# EAGLE schematic BeagleBeer (EAGLE 6.4)

## Sheet 1 of 2
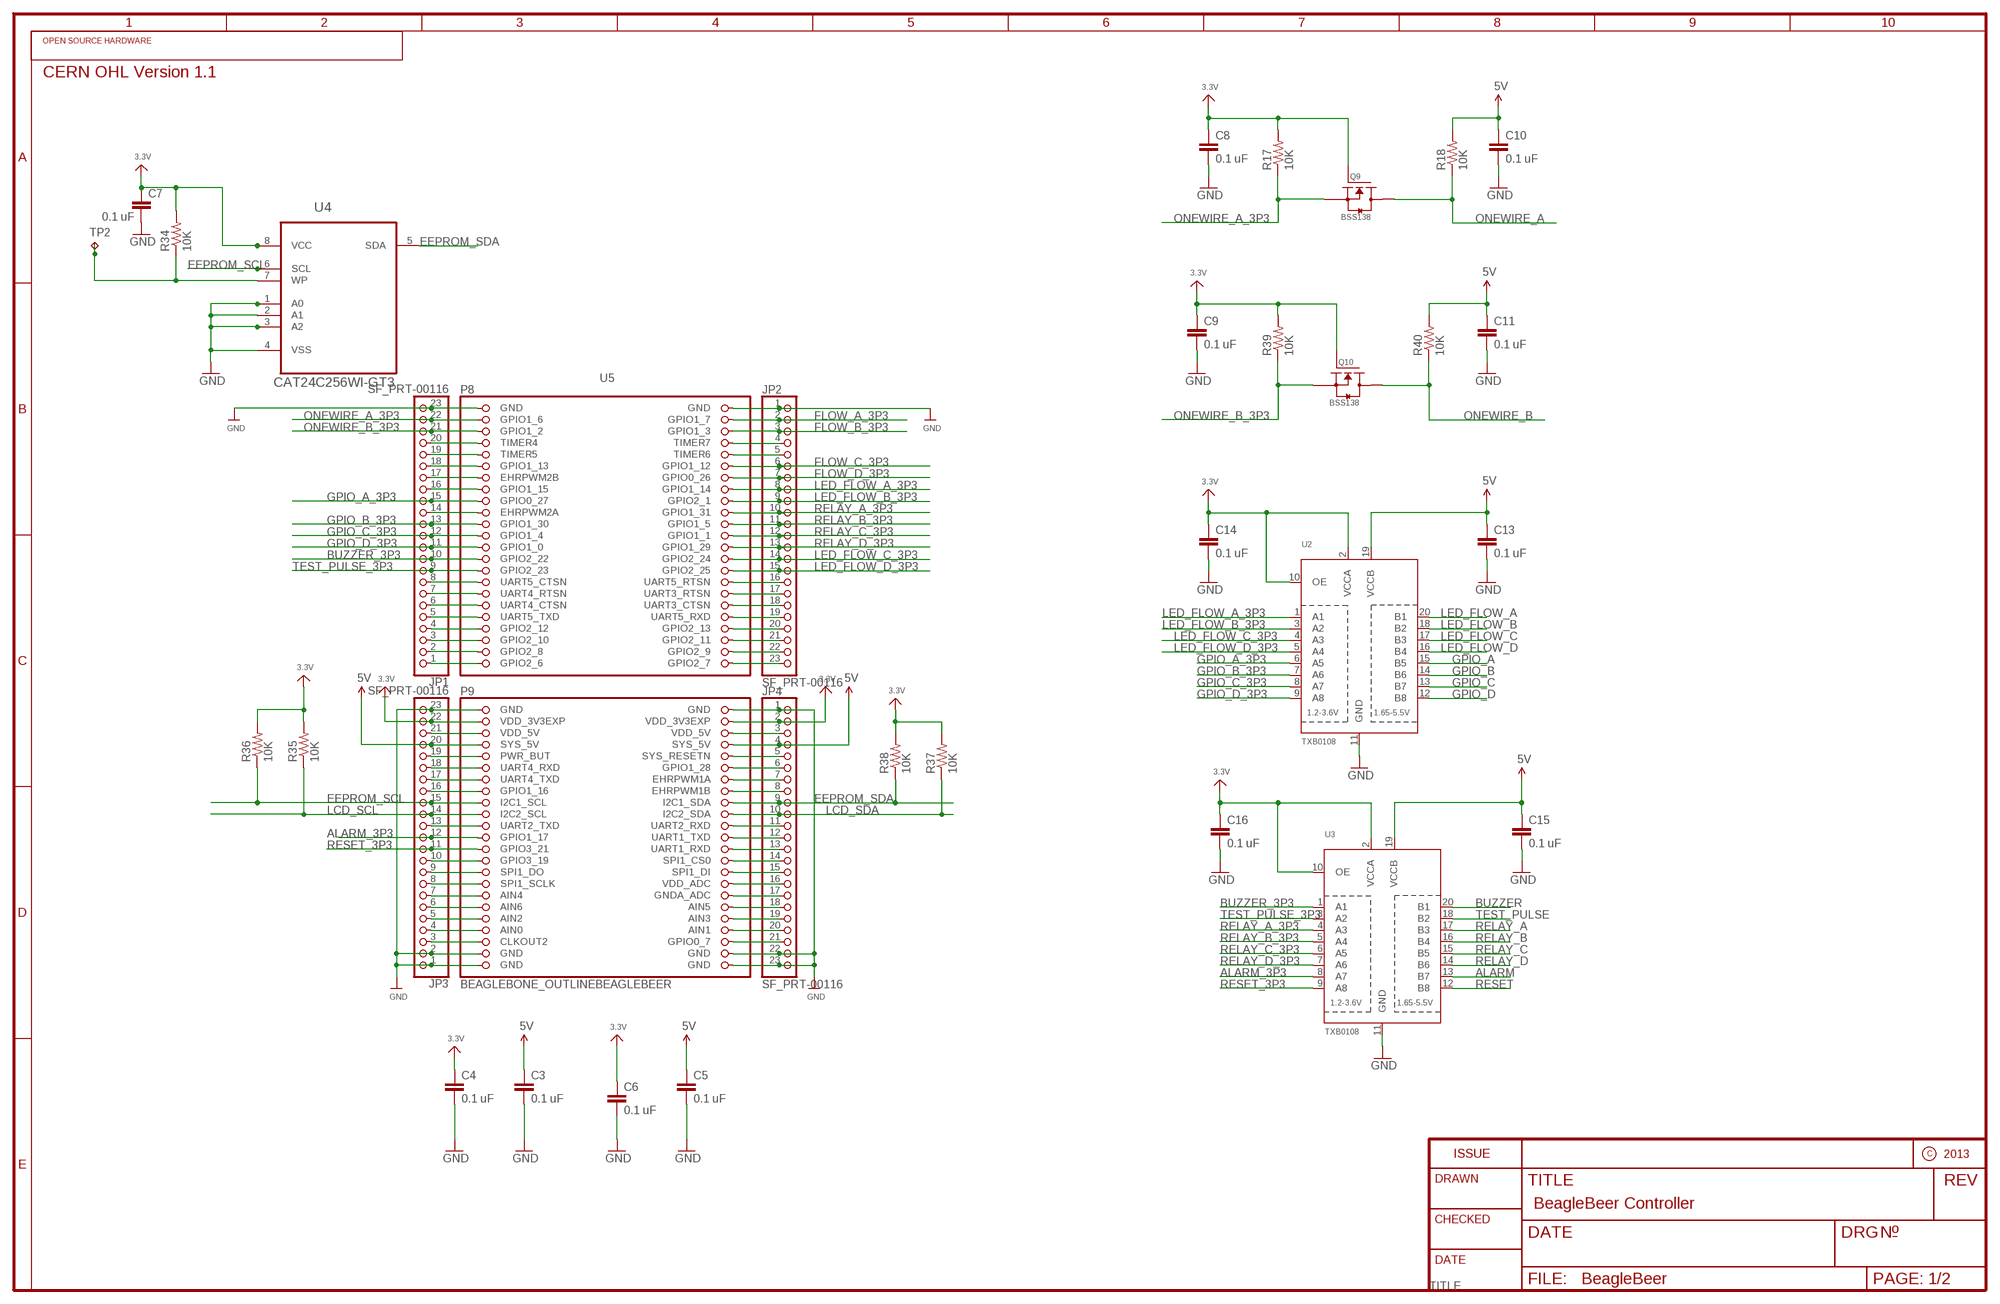
[diagram p0: schematic, sheet 1]
FRAME2 (US_11X17): CHECKED: Robin Coxe; COMPANY: Venture Cafe Foundation; DATE: 12-APR-2013; DRAWN: Robin Coxe; DRGNO: BB-0401; REV: 2; TITLE: BeagleBeer Controller

### Parts
C3  0.1 uF  CAP0805  [0805]
C4  0.1 uF  CAP0805  [0805]
C5  0.1 uF  CAP0805  [0805]
C6  0.1 uF  CAP0805  [0805]
C7  0.1 uF  CAP0805  [0805]
C8  0.1 uF  CAP0805  [0805]
C9  0.1 uF  CAP0805  [0805]
C10  0.1 uF  CAP0805  [0805]
C11  0.1 uF  CAP0805  [0805]
C13  0.1 uF  CAP0805  [0805]
C14  0.1 uF  CAP0805  [0805]
C15  0.1 uF  CAP0805  [0805]
C16  0.1 uF  CAP0805  [0805]
JP1  SF_PRT-00116  HEADER-1X23  [1X23_ROUND_70MIL]
JP2  SF_PRT-00116  HEADER-1X23  [1X23_ROUND_70MIL]
JP3  SF_PRT-00116  HEADER-1X23  [1X23_ROUND_70MIL]
JP4  SF_PRT-00116  HEADER-1X23  [1X23_ROUND_70MIL]
Q9  BSS138  MOSFET-N-GDS-D-SOT323  [SOT323]
Q10  BSS138  MOSFET-N-GDS-D-SOT323  [SOT323]
R17  10K  RESISTOR0805-RES  [0805]
R18  10K  RESISTOR0805-RES  [0805]
R34  10K  RESISTOR0805-RES  [0805]
R35  10K  RESISTOR0805-RES  [0805]
R36  10K  RESISTOR0805-RES  [0805]
R37  10K  RESISTOR0805-RES  [0805]
R38  10K  RESISTOR0805-RES  [0805]
R39  10K  RESISTOR0805-RES  [0805]
R40  10K  RESISTOR0805-RES  [0805]
TP2  TPTP18SQ  [TP18SQ]
U2  TXB0108  TXB0108PWR  [TSSOP20]
U3  TXB0108  TXB0108PWR  [TSSOP20]
U4  CAT24C256WI-GT3  [SOIC127P600X175-8N]
U5  BEAGLEBONE_OUTLINEBEAGLEBEER  [BEAGLEBEER_SHIELD]

### Nets
3.3V: C4.1 C6.1 C7.1 C8.1 C9.1 C14.1 C16.1 JP3.22 JP4.2 Q9.1(G) Q10.1(G) R17.2 R34.2 R35.2 R36.2 R37.2 R38.2 R39.2 U2.2(VCCA) U2.10(OE) U3.2(VCCA) U3.10(OE) U4.8(VCC) U5.49(VDD_3V3EXP) U5.50(VDD_3V3EXP) ; also sheet 2
5V: C3.1 C5.1 C10.1 C11.1 C13.1 C15.1 JP3.20 JP4.4 R18.2 R40.2 U2.19(VCCB) U3.19(VCCB) U5.53(SYS_5V) U5.54(SYS_5V) ; also sheet 2
ALARM: U3.13(B7) ; also sheet 2
ALARM_3P3: JP3.12 U3.8(A7) U5.69(GPIO1_17)
BUZZER: U3.20(B1) ; also sheet 2
BUZZER_3P3: JP1.10 U3.1(A1) U5.27(GPIO2_22)
EEPROM_SCL: JP3.15 R36.1 U4.6(SCL) U5.63(I2C1_SCL)
EEPROM_SDA: JP4.9 R38.1 U4.5(SDA) U5.64(I2C1_SDA)
FLOW_A_3P3: JP2.2 U5.4(GPIO1_7)
FLOW_B_3P3: JP2.3 U5.6(GPIO1_3)
FLOW_C_3P3: JP2.6 U5.12(GPIO1_12)
FLOW_D_3P3: JP2.7 U5.14(GPIO0_26)
GND: C3.2 C4.2 C5.2 C6.2 C7.2 C8.2 C9.2 C10.2 C11.2 C13.2 C14.2 C15.2 C16.2 JP1.23 JP2.1 JP3.1 JP3.2 JP3.23 JP4.1 JP4.22 JP4.23 U2.11(GND) U3.11(GND) U4.1(A0) U4.2(A1) U4.3(A2) U4.4(VSS) U5.1(GND) U5.2(GND) U5.47(GND) U5.48(GND) U5.89(GND) U5.90(GND) U5.91(GND) U5.92(GND) ; also sheet 2
GPIO_A: U2.15(B5) ; also sheet 2
GPIO_A_3P3: JP1.15 U2.6(A5) U5.17(GPIO0_27)
GPIO_B: U2.14(B6) ; also sheet 2
GPIO_B_3P3: JP1.13 U2.7(A6) U5.21(GPIO1_30)
GPIO_C: U2.13(B7) ; also sheet 2
GPIO_C_3P3: JP1.12 U2.8(A7) U5.23(GPIO1_4)
GPIO_D: U2.12(B8) ; also sheet 2
GPIO_D_3P3: JP1.11 U2.9(A8) U5.25(GPIO1_0)
LCD_SCL: JP3.14 R35.1 U5.65(I2C2_SCL)
LCD_SDA: JP4.10 R37.1 U5.66(I2C2_SDA)
LED_FLOW_A: U2.20(B1) ; also sheet 2
LED_FLOW_A_3P3: JP2.8 U2.1(A1) U5.16(GPIO1_14)
LED_FLOW_B: U2.18(B2) ; also sheet 2
LED_FLOW_B_3P3: JP2.9 U2.3(A2) U5.18(GPIO2_1)
LED_FLOW_C: U2.17(B3) ; also sheet 2
LED_FLOW_C_3P3: JP2.14 U2.4(A3) U5.28(GPIO2_24)
LED_FLOW_D: U2.16(B4) ; also sheet 2
LED_FLOW_D_3P3: JP2.15 U2.5(A4) U5.30(GPIO2_25)
N$2: JP1.2 U5.43(GPIO2_8)
N$3: JP1.1 U5.45(GPIO2_6)
N$4: JP1.20 U5.7(TIMER4)
N$5: JP1.19 U5.9(TIMER5)
N$6: JP2.16 U5.32(UART5_RTSN)
N$7: JP1.17 U5.13(EHRPWM2B)
N$8: JP2.17 U5.34(UART3_RTSN)
N$9: JP2.18 U5.36(UART3_CTSN)
N$10: JP1.14 U5.19(EHRPWM2A)
N$11: JP2.19 U5.38(UART5_RXD)
N$12: JP2.20 U5.40(GPIO2_13)
N$13: JP2.21 U5.42(GPIO2_11)
N$14: JP2.22 U5.44(GPIO2_9)
N$15: JP2.23 U5.46(GPIO2_7)
N$16: JP1.8 U5.31(UART5_CTSN)
N$17: JP1.7 U5.33(UART4_RTSN)
N$18: JP1.6 U5.35(UART4_CTSN)
N$19: JP1.5 U5.37(UART5_TXD)
N$20: JP1.4 U5.39(GPIO2_12)
N$21: JP1.3 U5.41(GPIO2_10)
N$27: JP2.4 U5.8(TIMER7)
N$28: JP2.5 U5.10(TIMER6)
N$49: JP3.21 U5.51(VDD_5V)
N$51: JP3.19 U5.55(PWR_BUT)
N$52: JP3.18 U5.57(UART4_RXD)
N$53: JP3.17 U5.59(UART4_TXD)
N$54: JP3.16 U5.61(GPIO1_16)
N$57: JP3.13 U5.67(UART2_TXD)
N$60: JP3.10 U5.73(GPIO3_19)
N$61: JP3.9 U5.75(SPI1_DO)
N$62: JP3.8 U5.77(SPI1_SCLK)
N$63: JP3.7 U5.79(AIN4)
N$64: JP3.6 U5.81(AIN6)
N$65: JP3.5 U5.83(AIN2)
N$66: JP3.4 U5.85(AIN0)
N$67: JP3.3 U5.87(CLKOUT2)
N$69: JP4.21 U5.88(GPIO0_7)
N$72: JP4.3 U5.52(VDD_5V)
N$74: JP4.5 U5.56(SYS_RESETN)
N$75: JP4.6 U5.58(GPIO1_28)
N$76: JP4.7 U5.60(EHRPWM1A)
N$77: JP4.8 U5.62(EHRPWM1B)
N$80: JP4.11 U5.68(UART2_RXD)
N$81: JP4.12 U5.70(UART1_TXD)
N$82: JP4.13 U5.72(UART1_RXD)
N$83: JP4.14 U5.74(SPI1_CS0)
N$84: JP4.15 U5.76(SPI1_DI)
N$85: JP4.16 U5.78(VDD_ADC)
N$86: JP4.17 U5.80(GNDA_ADC)
N$87: JP4.18 U5.82(AIN5)
N$88: JP4.19 U5.84(AIN3)
N$89: JP4.20 U5.86(AIN1)
N$102: R34.1 TP2.TP U4.7(WP)
ONEWIRE_A: Q9.3(D1) R18.1 ; also sheet 2
ONEWIRE_A_3P3: JP1.22 Q9.2(S) R17.1 U5.3(GPIO1_6)
ONEWIRE_B: Q10.3(D1) R40.1 ; also sheet 2
ONEWIRE_B_3P3: JP1.21 Q10.2(S) R39.1 U5.5(GPIO1_2)
ONEWIRE_C_3P3: JP1.18 U5.11(GPIO1_13)
ONEWIRE_D_3P3: JP1.16 U5.15(GPIO1_15)
RELAY_A: U3.17(B3) ; also sheet 2
RELAY_A_3P3: JP2.10 U3.4(A3) U5.20(GPIO1_31)
RELAY_B: U3.16(B4) ; also sheet 2
RELAY_B_3P3: JP2.11 U3.5(A4) U5.22(GPIO1_5)
RELAY_C: U3.15(B5) ; also sheet 2
RELAY_C_3P3: JP2.12 U3.6(A5) U5.24(GPIO1_1)
RELAY_D: U3.14(B6) ; also sheet 2
RELAY_D_3P3: JP2.13 U3.7(A6) U5.26(GPIO1_29)
RESET: U3.12(B8) ; also sheet 2
RESET_3P3: JP3.11 U3.9(A8) U5.71(GPIO3_21)
TEST_PULSE: U3.18(B2) ; also sheet 2
TEST_PULSE_3P3: JP1.9 U3.3(A2) U5.29(GPIO2_23)

### Notes on the sheet
- BeagleBeer Controller

## Sheet 2 of 2
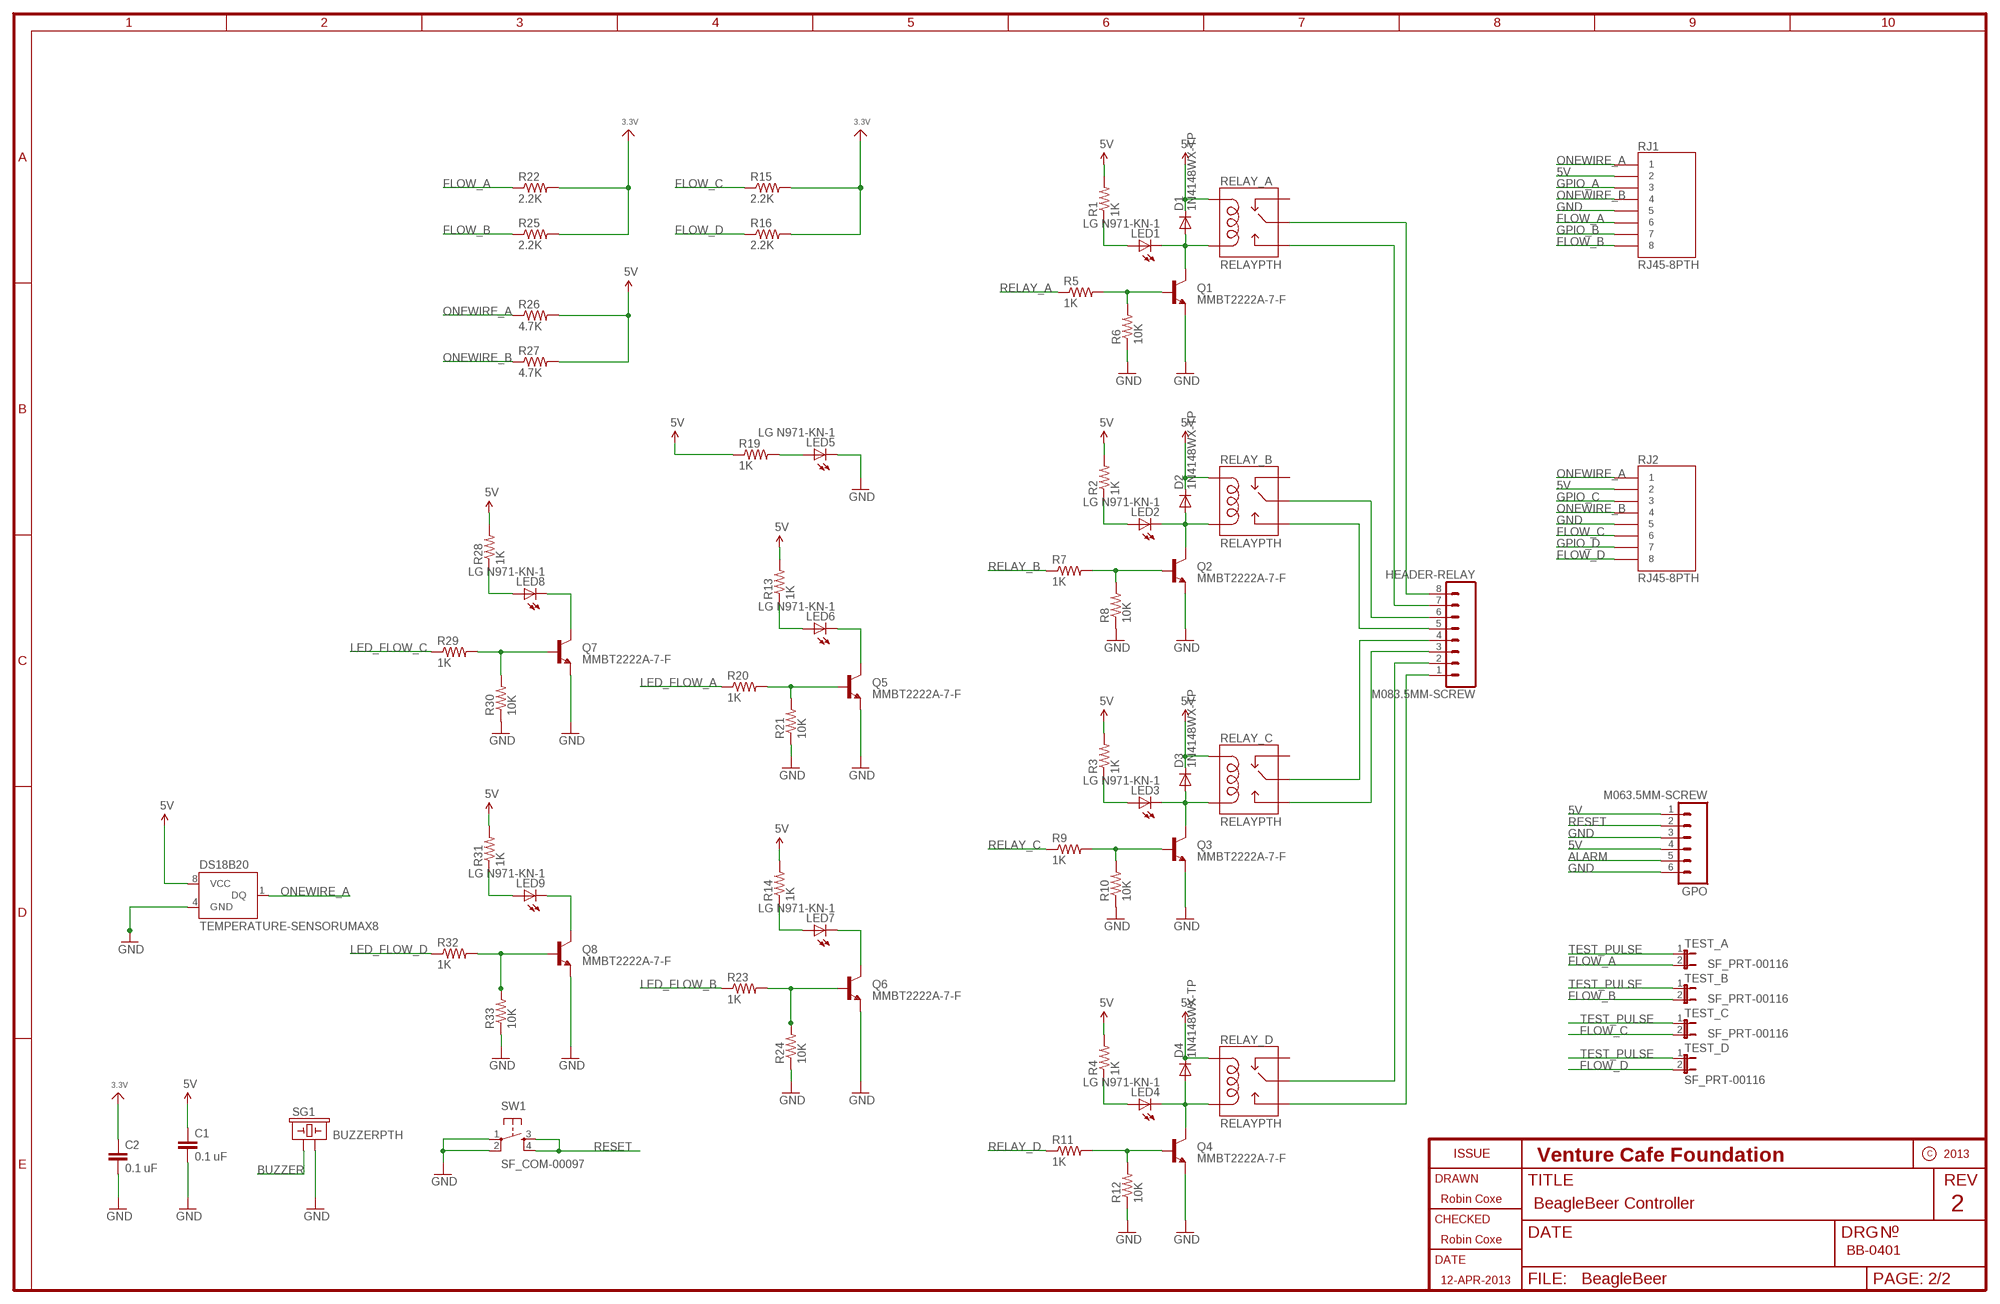
[diagram p1: schematic, sheet 2]
FRAME1 (US_11X17): CHECKED: Robin Coxe; COMPANY: Venture Cafe Foundation; DATE: 12-APR-2013; DRAWN: Robin Coxe; DRGNO: BB-0401; REV: 2

### Parts
C1  0.1 uF  CAP0805  [0805]
C2  0.1 uF  CAP0805  [0805]
D1  1N4148WX-TP  DIODESOD  [SOD-323]
D2  1N4148WX-TP  DIODESOD  [SOD-323]
D3  1N4148WX-TP  DIODESOD  [SOD-323]
D4  1N4148WX-TP  DIODESOD  [SOD-323]
GPO  M063.5MM-SCREW  M063.5MM-6  [SCREWTERMINAL-3.5MM-6]
HEADER-RELAY  M083.5MM-SCREW  M083.5MM-8  [SCREWTERMINAL-3.5MM-8]
LED1  LG N971-KN-1  LED1206  [LED-1206]
LED2  LG N971-KN-1  LED1206  [LED-1206]
LED3  LG N971-KN-1  LED1206  [LED-1206]
LED4  LG N971-KN-1  LED1206  [LED-1206]
LED5  LG N971-KN-1  LED1206  [LED-1206]
LED6  LG N971-KN-1  LED1206  [LED-1206]
LED7  LG N971-KN-1  LED1206  [LED-1206]
LED8  LG N971-KN-1  LED1206  [LED-1206]
LED9  LG N971-KN-1  LED1206  [LED-1206]
Q1  MMBT2222A-7-F  TRANSISTOR_NPNSOT23-3  [SOT23-3]
Q2  MMBT2222A-7-F  TRANSISTOR_NPNSOT23-3  [SOT23-3]
Q3  MMBT2222A-7-F  TRANSISTOR_NPNSOT23-3  [SOT23-3]
Q4  MMBT2222A-7-F  TRANSISTOR_NPNSOT23-3  [SOT23-3]
Q5  MMBT2222A-7-F  TRANSISTOR_NPNSOT23-3  [SOT23-3]
Q6  MMBT2222A-7-F  TRANSISTOR_NPNSOT23-3  [SOT23-3]
Q7  MMBT2222A-7-F  TRANSISTOR_NPNSOT23-3  [SOT23-3]
Q8  MMBT2222A-7-F  TRANSISTOR_NPNSOT23-3  [SOT23-3]
R1  1K  RESISTOR0805-RES  [0805]
R2  1K  RESISTOR0805-RES  [0805]
R3  1K  RESISTOR0805-RES  [0805]
R4  1K  RESISTOR0805-RES  [0805]
R5  1K  RESISTOR0805-RES  [0805]
R6  10K  RESISTOR0805-RES  [0805]
R7  1K  RESISTOR0805-RES  [0805]
R8  10K  RESISTOR0805-RES  [0805]
R9  1K  RESISTOR0805-RES  [0805]
R10  10K  RESISTOR0805-RES  [0805]
R11  1K  RESISTOR0805-RES  [0805]
R12  10K  RESISTOR0805-RES  [0805]
R13  1K  RESISTOR0805-RES  [0805]
R14  1K  RESISTOR0805-RES  [0805]
R15  2.2K  RESISTOR0805-RES  [0805]
R16  2.2K  RESISTOR0805-RES  [0805]
R19  1K  RESISTOR0805-RES  [0805]
R20  1K  RESISTOR0805-RES  [0805]
R21  10K  RESISTOR0805-RES  [0805]
R22  2.2K  RESISTOR0805-RES  [0805]
R23  1K  RESISTOR0805-RES  [0805]
R24  10K  RESISTOR0805-RES  [0805]
R25  2.2K  RESISTOR0805-RES  [0805]
R26  4.7K  RESISTOR0805-RES  [0805]
R27  4.7K  RESISTOR0805-RES  [0805]
R28  1K  RESISTOR0805-RES  [0805]
R29  1K  RESISTOR0805-RES  [0805]
R30  10K  RESISTOR0805-RES  [0805]
R31  1K  RESISTOR0805-RES  [0805]
R32  1K  RESISTOR0805-RES  [0805]
R33  10K  RESISTOR0805-RES  [0805]
RELAY_A  RELAYPTH  [RELAY-G5Q]
RELAY_B  RELAYPTH  [RELAY-G5Q]
RELAY_C  RELAYPTH  [RELAY-G5Q]
RELAY_D  RELAYPTH  [RELAY-G5Q]
RJ1  RJ45-8PTH  [RJ45-8]
RJ2  RJ45-8PTH  [RJ45-8]
SG1  BUZZERPTH  [BUZZER-12MM]
SW1  SF_COM-00097  TAC_SWITCHPTH  [TACTILE-PTH]
TEST_A  SF_PRT-00116  JUMPER-2PTH  [1X02]
TEST_B  SF_PRT-00116  JUMPER-2PTH  [1X02]
TEST_C  SF_PRT-00116  JUMPER-2PTH  [1X02]
TEST_D  SF_PRT-00116  JUMPER-2PTH  [1X02]
U1  TEMPERATURE-SENSORUMAX8  [UMAX8]

### Nets
3.3V: C2.1 R15.2 R16.2 R22.2 R25.2 ; also sheet 1
5V: C1.1 D1.1(C) D2.1(C) D3.1(C) D4.1(C) GPO.1 GPO.4 R1.2 R2.2 R3.2 R4.2 R13.2 R14.2 R19.1 R26.2 R27.2 R28.2 R31.2 RELAY_A.5(COIL1) RELAY_B.5(COIL1) RELAY_C.5(COIL1) RELAY_D.5(COIL1) RJ1.2 RJ2.2 U1.8(VCC) ; also sheet 1
ALARM: GPO.5 ; also sheet 1
BUZZER: SG1.+ ; also sheet 1
FLOW_A: R22.1 RJ1.6 TEST_A.2
FLOW_B: R25.1 RJ1.8 TEST_B.2
FLOW_C: R15.1 RJ2.6 TEST_C.2
FLOW_D: R16.1 RJ2.8 TEST_D.2
GND: C1.2 C2.2 GPO.3 GPO.6 LED5.C Q1.2(E) Q2.2(E) Q3.2(E) Q4.2(E) Q5.2(E) Q6.2(E) Q7.2(E) Q8.2(E) R6.1 R8.1 R10.1 R12.1 R21.1 R24.1 R30.1 R33.1 RJ1.5 RJ2.5 SG1.- SW1.1 SW1.2 U1.4(GND) ; also sheet 1
GPIO_A: RJ1.3 ; also sheet 1
GPIO_B: RJ1.7 ; also sheet 1
GPIO_C: RJ2.3 ; also sheet 1
GPIO_D: RJ2.7 ; also sheet 1
LED_FLOW_A: R20.1 ; also sheet 1
LED_FLOW_B: R23.1 ; also sheet 1
LED_FLOW_C: R29.1 ; also sheet 1
LED_FLOW_D: R32.1 ; also sheet 1
N$1: LED8.C Q7.3(C)
N$25: LED8.A R28.1
N$26: Q7.1(B) R29.2 R30.2
N$42: LED9.C Q8.3(C)
N$70: D1.2(A) LED1.C Q1.3(C) RELAY_A.1(COIL2)
N$71: D2.2(A) LED2.C Q2.3(C) RELAY_B.1(COIL2)
N$73: D3.2(A) LED3.C Q3.3(C) RELAY_C.1(COIL2)
N$90: D4.2(A) LED4.C Q4.3(C) RELAY_D.1(COIL2)
N$91: Q1.1(B) R5.2 R6.2
N$92: Q2.1(B) R7.2 R8.2
N$93: Q3.1(B) R9.2 R10.2
N$94: Q4.1(B) R11.2 R12.2
N$95: LED5.A R19.2
N$96: HEADER-RELAY.8 RELAY_A.2(MAIN)
N$97: HEADER-RELAY.7 RELAY_A.3(NO)
N$98: HEADER-RELAY.6 RELAY_B.2(MAIN)
N$99: HEADER-RELAY.5 RELAY_B.3(NO)
N$100: LED9.A R31.1
N$101: Q8.1(B) R32.2 R33.2
N$106: HEADER-RELAY.4 RELAY_C.2(MAIN)
N$107: HEADER-RELAY.3 RELAY_C.3(NO)
N$108: HEADER-RELAY.2 RELAY_D.2(MAIN)
N$109: HEADER-RELAY.1 RELAY_D.3(NO)
N$111: LED1.A R1.1
N$112: LED2.A R2.1
N$113: LED3.A R3.1
N$114: LED4.A R4.1
N$117: LED6.C Q5.3(C)
N$118: LED6.A R13.1
N$119: Q5.1(B) R20.2 R21.2
N$120: LED7.C Q6.3(C)
N$121: LED7.A R14.1
N$122: Q6.1(B) R23.2 R24.2
ONEWIRE_A: R26.1 RJ1.1 RJ2.1 U1.1(DQ) ; also sheet 1
ONEWIRE_B: R27.1 RJ1.4 RJ2.4 ; also sheet 1
RELAY_A: R5.1 ; also sheet 1
RELAY_B: R7.1 ; also sheet 1
RELAY_C: R9.1 ; also sheet 1
RELAY_D: R11.1 ; also sheet 1
RESET: GPO.2 SW1.3 SW1.4 ; also sheet 1
TEST_PULSE: TEST_A.1 TEST_B.1 TEST_C.1 TEST_D.1 ; also sheet 1
Unconnected: RELAY_A.4(NC) RELAY_B.4(NC) RELAY_C.4(NC) RELAY_D.4(NC)

### Notes on the sheet
- BeagleBeer Controller

## Library data of the parts
C1-C11 C13-C16 = geoffculp:CAP: Capacitor Standard 0603 ceramic capacitor, and 0.1" leaded capacitor.
D1-D4 = geoffculp:DIODE: Diode These are standard reverse protection diodes and small signal diodes. SMA package can handle up to about 1A. SOD-323 can handle about 200mA. What the SOD-323 package when ordering, there are some mfgs out there that are 5-pin packages.
GPO = SparkFun:M06: Header 6 Standard 6-pin 0.1" header. Use with straight break away headers (SKU : PRT-00116), right angle break away headers (PRT-00553), swiss pins (PRT-00743), machine pins (PRT-00117), and female headers (PRT-00115). Molex polarized connector foot print use with SKU : PRT-08094 with associated crimp pins and housings. NOTES ON THE VARIANTS LOCK and LOCK_LONGPADS... This footprint was designed to help hold the alignment of a through-hole component (i.e. 6-pin header) while soldering it into place. You may notice that each hole has been shifted either up or down by 0.005 of an inch from it's more standard position (which is a perfectly straight line). This slight alteration caused the pins (the squares in the middle) to touch the edges of the holes. Because they are alternating, it causes a "brace" to hold the component in place. 0.005 has proven to be the perfect amount of "off-center" position when using our standard breakaway headers. Although looks a little odd when you look at the bare footprint, once you have a header in there, the alteration is very hard to notice. Also, if you push a header all the way into place, it is covered up entirely on the bottom side. This idea of altering the position of holes to aid alignment will be further integrated into the Sparkfun Library for other footprints. It can help hold any component with 3 or more connection pins.
HEADER-RELAY = SparkFun:M08: Header 8 Standard 8-pin 0.1" header. Use with straight break away headers (SKU : PRT-00116), right angle break away headers (PRT-00553), swiss pins (PRT-00743), machine pins (PRT-00117), and female headers (PRT-00115).
JP1-JP4 = microbuilder:HEADER-1X23
LED1-LED9 = SparkFun-LED:LED: LEDs Standard schematic elements and footprints for 5mm, 3mm, 1206, and 0603 sized LEDs. 5mm - Spark Fun Electronics SKU : COM-00529 (and others)
Q1-Q8 = geoffculp:TRANSISTOR_NPN: Transistor NPN BJT configuration in SOT23 package. MMBT2222 is the common NPN we use. Double check BCE configuration again layout.
Q9 Q10 = dan-transistor:MOSFET-N-GDS-D
R1-R40 = geoffculp:RESISTOR: Resistor Basic schematic elements and footprints for 0603, 1206, and PTH resistors.
RELAY_A RELAY_B RELAY_C RELAY_D = SparkFun:RELAY
RJ1 RJ2 = SparkFun:RJ45-8: RJ45 Jack Simple RJ45, 8-pin connection - connector for common Cat5, Cat5e, and Cat6 Ethernet cables. Footprint not yet proven in production. Connector sku is PRT-00643; Breakout PCB sku is BOB-00716.
SG1 = SparkFun:BUZZER: Buzzer 12mm Spark Fun Electronics SKU : Comp-Buzzer
SW1 = SparkFun:TAC_SWITCH: Momentary Switch Button commonly used for reset or general input. Spark Fun Electronics SKU : COM-00097
TEST_A TEST_B TEST_C TEST_D = SparkFun-20100412:JUMPER-2: Jumper Basic 0.1" spaced jumper. Use with breakaway headers.
TP2 = testpad:TP: Test pad
U1 = geoffculp:TEMPERATURE-SENSOR
U2 U3 = adafruit:TXB0108PWR: 8-Bit Bi-Directional Level Shifter 1.2V-3.6V (VCCA) to 1.65V-5.5V (VCCB) bi-directional level shifter with auto direction sensing. Max data rate - VCCA 1.8V: 20Mbps (50ns), VCCA 3.3V: 100Mbps (10ns) Digikey: 296-21527-1-ND
U4 = ON Semiconductor_By_element14_Batch_1:CAT24C256WI-GT3
U5 = adafruit:BEAGLEBONE_OUTLINE: Should match A3 pinout - but not completely tested